# Altium schematic sheet Main.BoardSchDoc.SchDoc
size A3; SheetNumber: 1; SheetTotal: 9; SPICEModelCachePYKVLZSU: <root> / <DocumentId>PYKVLZSU</DocumentId> / </root>
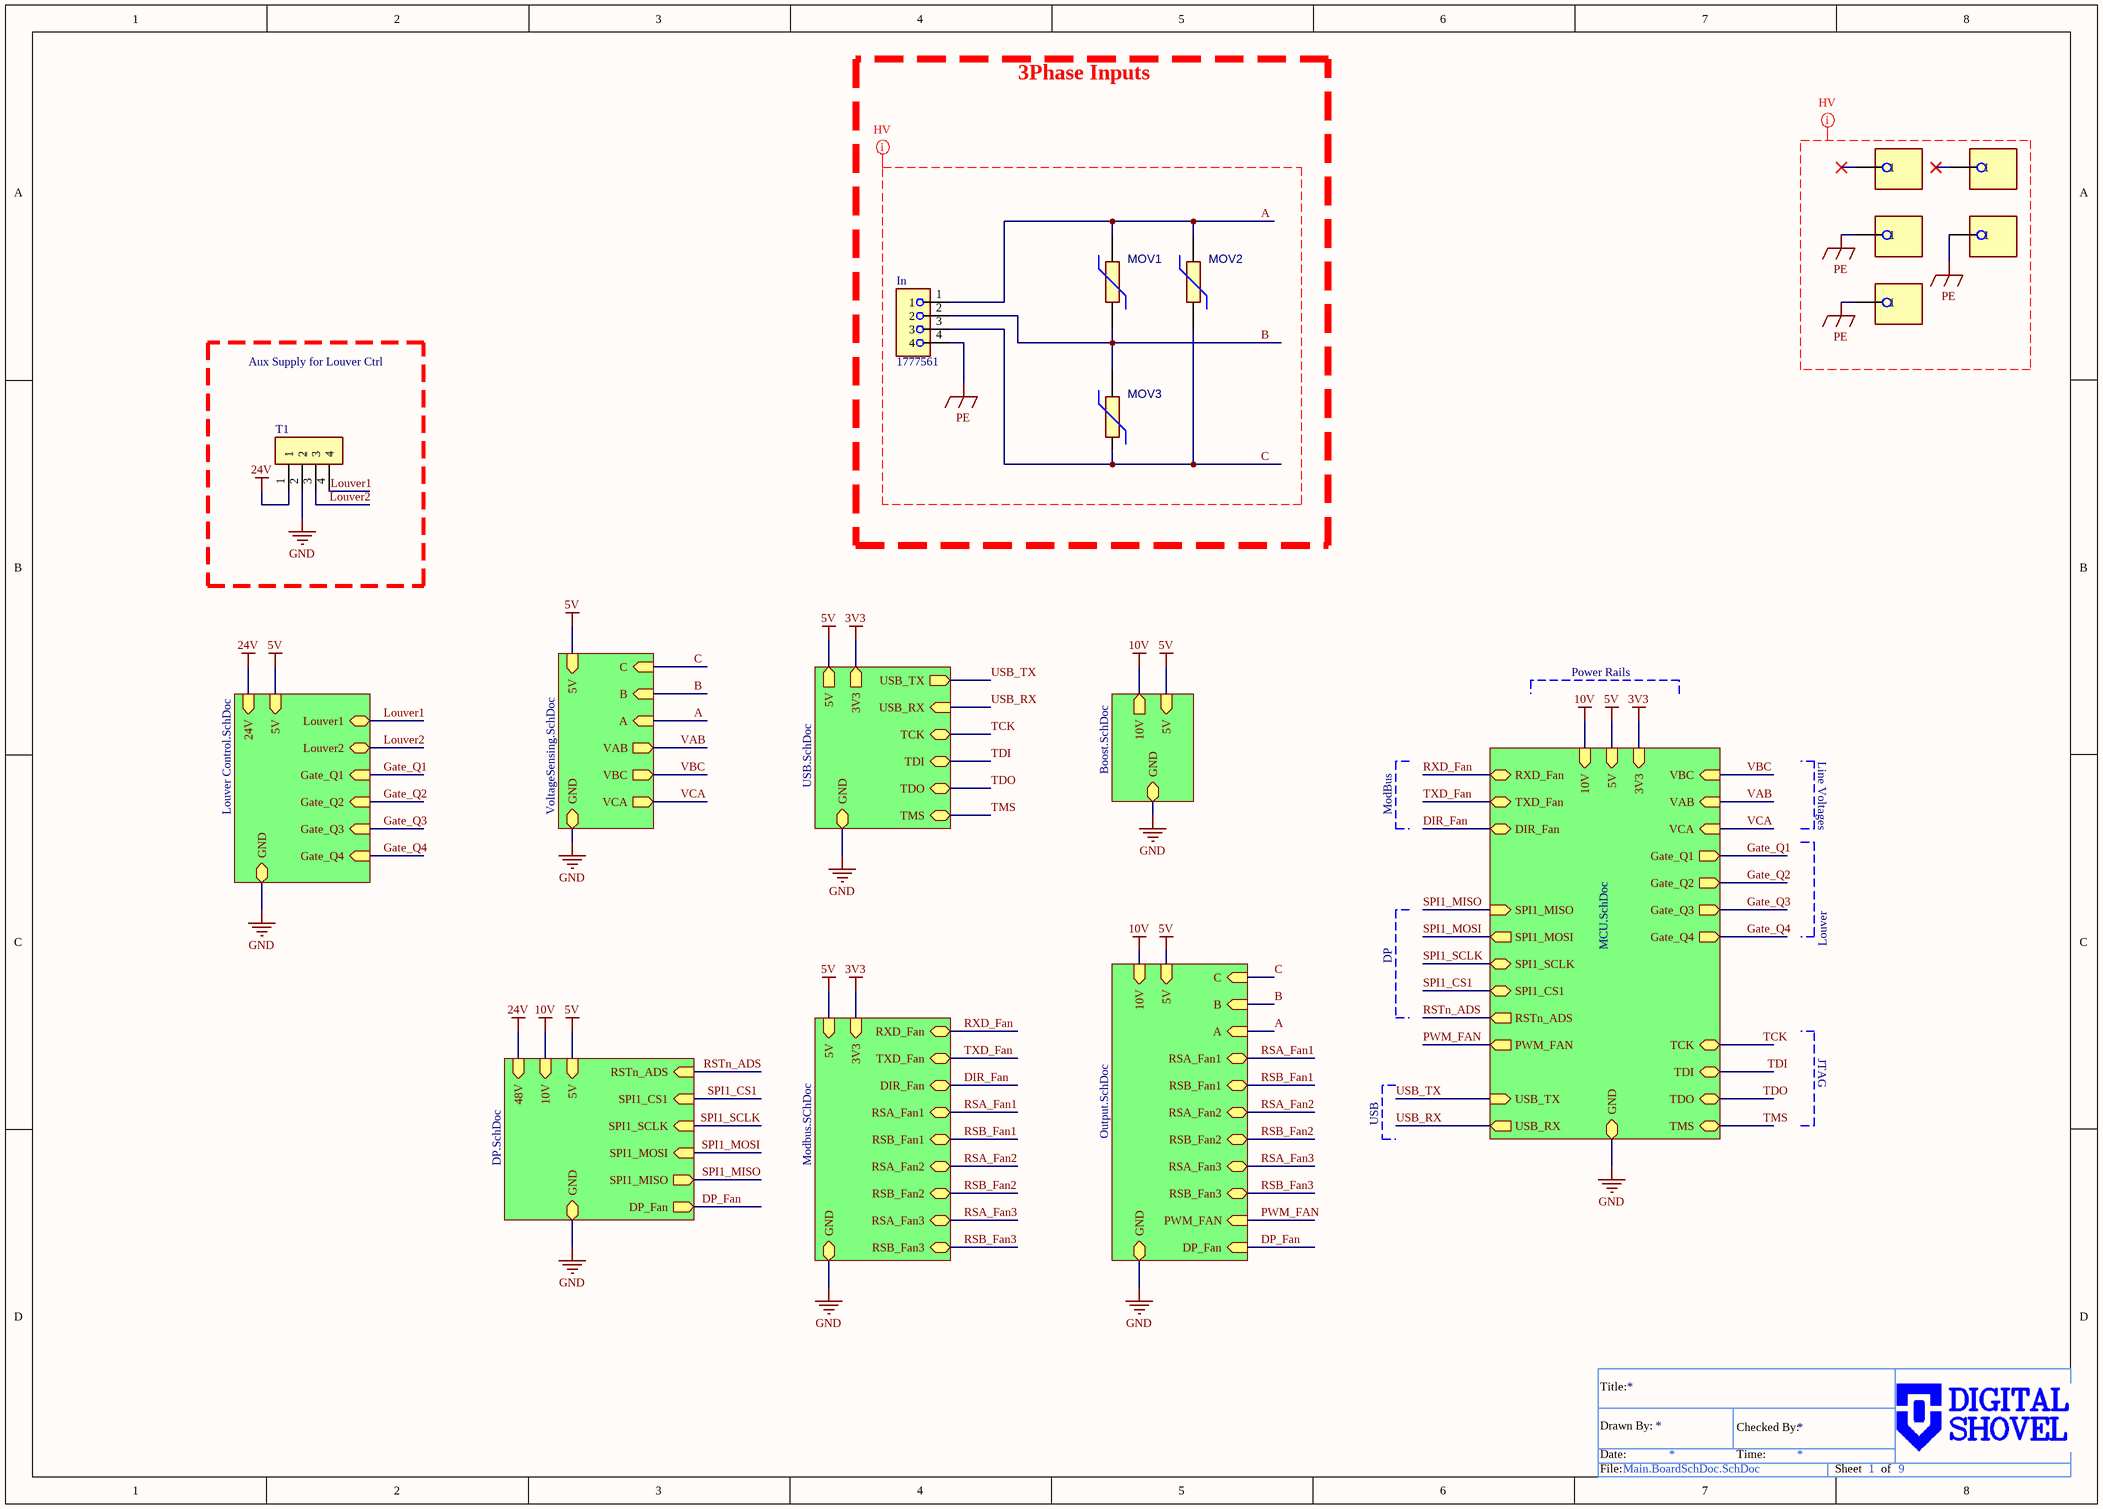
[diagram p0: Main.BoardSchDoc.SchDoc]

## Parts
1  Mounting Hole  [Mounting Hole]  (value not drawn)
3  Mounting Hole  [Mounting Hole]  (value not drawn)
4  Mounting Hole  [Mounting Hole]  (value not drawn)
5  Mounting Hole  [Mounting Hole]  (value not drawn)
6  Mounting Hole  [Mounting Hole]  (value not drawn)
In  1777561  [1777561-Footprint-1]
MOV1  MOV-14D102K  [MOV-14D102K-Footprint-1]  (value not drawn)
MOV2  MOV-14D102K  [MOV-14D102K-Footprint-1]  (value not drawn)
MOV3  MOV-14D102K  [MOV-14D102K-Footprint-1]  (value not drawn)
T1  1984633  [1984633-Footprint-1]  (value not drawn)

## Blocks framed on the sheet
3Phase Inputs: In MOV1-MOV3
Aux Supply for Louver Ctrl: T1

## Sub-sheets
Designator = VoltageSensing.SchDoc: GND (bidir), 5V (in), A (in), B (in), C (in), VAB (out), VBC (out), VCA (out)
Designator = Boost.SchDoc: GND (bidir), 5V (in), 10V (out)
Designator = Output.SchDoc: GND (bidir), 10V (in), A (in), B (in), C (in), 5V (in), RSA_Fan1 (bidir), RSB_Fan1 (bidir), RSA_Fan2 (bidir), RSB_Fan2 (bidir), RSA_Fan3 (bidir), RSB_Fan3 (bidir), PWM_FAN (in), DP_Fan (in)
Designator = MCU.SchDoc: VAB (in), VBC (in), VCA (in), GND (bidir), SPI1_MISO (in), SPI1_MOSI (out), SPI1_SCLK (bidir), SPI1_CS1 (bidir), 5V (in), PWM_FAN (out), RSTn_ADS (out), USB_TX (in), USB_RX (out), 3V3 (in), TCK (bidir), TDI (bidir), TDO (bidir), TMS (bidir), RXD_Fan (bidir), TXD_Fan (bidir), 10V (in), DIR_Fan (bidir), Gate_Q1 (out), Gate_Q2 (out), Gate_Q3 (out), Gate_Q4 (out)
Designator = USB.SchDoc: GND (bidir), TDI (bidir), USB_TX (out), USB_RX (in), TCK (bidir), 5V (out), TDO (bidir), 3V3 (out), TMS (bidir)
Designator = Modbus.SChDoc: GND (bidir), RXD_Fan (bidir), TXD_Fan (bidir), 5V (in), 3V3 (in), RSA_Fan1 (bidir), RSB_Fan1 (bidir), RSA_Fan2 (bidir), RSB_Fan2 (bidir), RSA_Fan3 (bidir), RSB_Fan3 (bidir), DIR_Fan (bidir)
Designator = DP.SchDoc: GND (bidir), SPI1_CS1 (in), SPI1_MISO (out), SPI1_MOSI (in), SPI1_SCLK (in), 5V (in), RSTn_ADS (in), DP_Fan (out), 10V (in), 48V (in)
Designator = Louver Control.SchDoc: GND (bidir), 24V (in), Louver1 (bidir), Louver2 (bidir), 5V (in), Gate_Q1 (in), Gate_Q2 (in), Gate_Q3 (in), Gate_Q4 (in)

## Nets
3V3: sheet Designator/3V3, sheet Designator/3V3, sheet Designator/3V3
5V: sheet Designator/5V, sheet Designator/5V, sheet Designator/5V, sheet Designator/5V, sheet Designator/5V, sheet Designator/5V, sheet Designator/5V, sheet Designator/5V
10V: sheet Designator/10V, sheet Designator/10V, sheet Designator/10V, sheet Designator/10V
24V: T1.1 ; sheet Designator/48V, sheet Designator/24V
GND: T1.2 ; sheet Designator/GND, sheet Designator/GND, sheet Designator/GND, sheet Designator/GND, sheet Designator/GND, sheet Designator/GND, sheet Designator/GND, sheet Designator/GND
PE: 1.1 5.1 6.1 In.4
A: In.1 MOV1.2 MOV2.2 ; sheet Designator/A, sheet Designator/A
B: In.2 MOV1.1 MOV3.2 ; sheet Designator/B, sheet Designator/B
C: In.3 MOV2.1 MOV3.1 ; sheet Designator/C, sheet Designator/C
DIR_Fan: sheet Designator/DIR_Fan, sheet Designator/DIR_Fan
DP_Fan: sheet Designator/DP_Fan, sheet Designator/DP_Fan
Gate_Q1: sheet Designator/Gate_Q1, sheet Designator/Gate_Q1
Gate_Q2: sheet Designator/Gate_Q2, sheet Designator/Gate_Q2
Gate_Q3: sheet Designator/Gate_Q3, sheet Designator/Gate_Q3
Gate_Q4: sheet Designator/Gate_Q4, sheet Designator/Gate_Q4
Louver1: T1.4 ; sheet Designator/Louver1
Louver2: T1.3 ; sheet Designator/Louver2
PWM_FAN: sheet Designator/PWM_FAN, sheet Designator/PWM_FAN
RSA_Fan1: sheet Designator/RSA_Fan1, sheet Designator/RSA_Fan1
RSA_Fan2: sheet Designator/RSA_Fan2, sheet Designator/RSA_Fan2
RSA_Fan3: sheet Designator/RSA_Fan3, sheet Designator/RSA_Fan3
RSB_Fan1: sheet Designator/RSB_Fan1, sheet Designator/RSB_Fan1
RSB_Fan2: sheet Designator/RSB_Fan2, sheet Designator/RSB_Fan2
RSB_Fan3: sheet Designator/RSB_Fan3, sheet Designator/RSB_Fan3
RSTn_ADS: sheet Designator/RSTn_ADS, sheet Designator/RSTn_ADS
RXD_Fan: sheet Designator/RXD_Fan, sheet Designator/RXD_Fan
SPI1_CS1: sheet Designator/SPI1_CS1, sheet Designator/SPI1_CS1
SPI1_MISO: sheet Designator/SPI1_MISO, sheet Designator/SPI1_MISO
SPI1_MOSI: sheet Designator/SPI1_MOSI, sheet Designator/SPI1_MOSI
SPI1_SCLK: sheet Designator/SPI1_SCLK, sheet Designator/SPI1_SCLK
TCK: sheet Designator/TCK, sheet Designator/TCK
TDI: sheet Designator/TDI, sheet Designator/TDI
TDO: sheet Designator/TDO, sheet Designator/TDO
TMS: sheet Designator/TMS, sheet Designator/TMS
TXD_Fan: sheet Designator/TXD_Fan, sheet Designator/TXD_Fan
USB_RX: sheet Designator/USB_RX, sheet Designator/USB_RX
USB_TX: sheet Designator/USB_TX, sheet Designator/USB_TX
VAB: sheet Designator/VAB, sheet Designator/VAB
VBC: sheet Designator/VBC, sheet Designator/VBC
VCA: sheet Designator/VCA, sheet Designator/VCA

Not connected (* = marked no-connect by the designer): 3 1*; 4 1*

## Layout directives
net class HV: A, B, C, PE

## Notes on the sheet
- Power Rails
- Line Voltages
- ModBus
- Louver
- DP
- JTAG
- USB
- Title:
- Date:
- Drawn By:
- Time:
- Checked By:
- File:
- Sheet
- of

## Library data of the parts
1 3-6 = CMP-002-00649-4: Aluminum 1/4 Hex Female Standoff, 4MM
In = CMP-002-01216-2: 4 Position Wire to Board Terminal Block Horizontal with Board 0.250" (6.35mm) Through Hole; Voltage Rating: 1kV; Max Current Rating: 30A; Mounting Technology: Board; RoHS Compliant: Yes
MOV1-MOV3 = CMP-009-01038-1: Varistor, 825V, 190J, Through Hole Mount; Power: 600mW; Pins: 2; Max Operating Temperature: 85°C; RoHS Compliant: Yes; Min Operating Temperature: -40°C; Mounting Technology: Through Hole
T1 = CMP-002-01217-1: Barrier Strip Terminal Block, 17.5A, 1.5mm2, 1 Row(s), 1 Deck(s); Voltage Rating: 200V; RoHS Compliant: Yes; Mounting Technology: Board